# Altium schematic sheet CH32V003-NFC-EVT-R0-1v0.SchDoc
size 304 x 203 mm; SheetNumber: 0; SheetTotal: 0
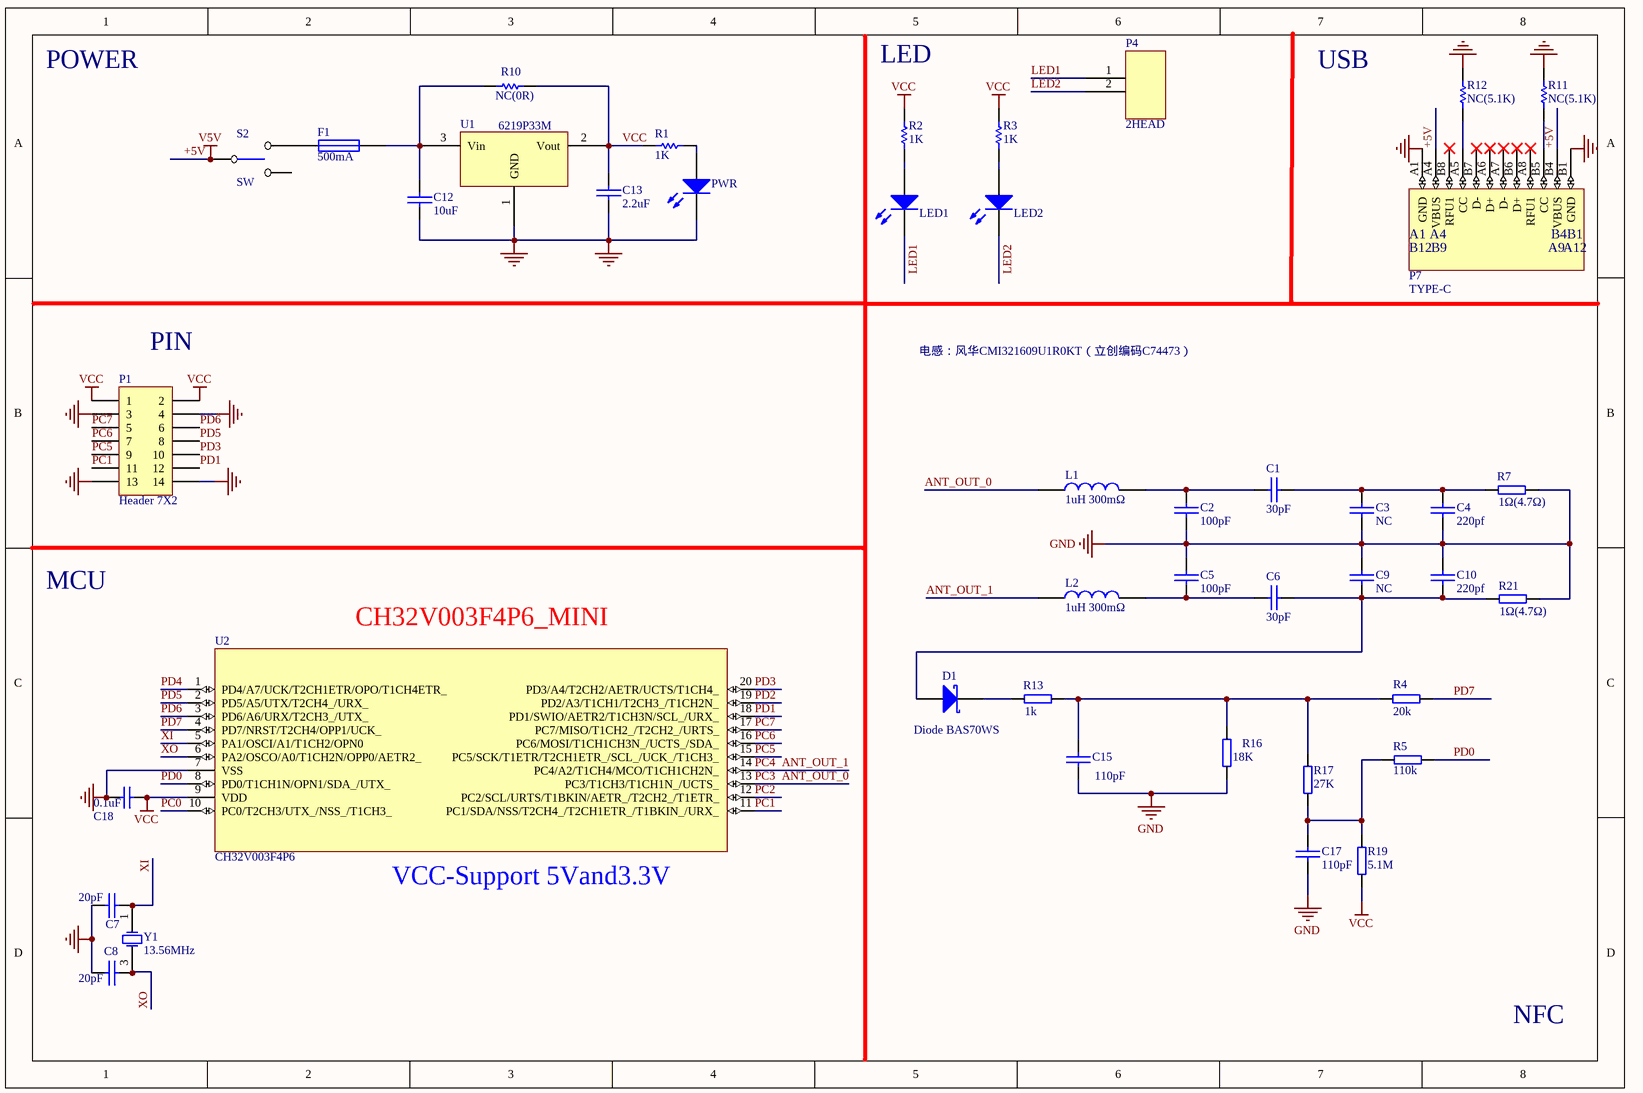
[diagram p0: CH32V003-NFC-EVT-R0-1v0.SchDoc]

## Parts
C1  30pF  [0603_C]
C2  100pF  [0603_C]
C3  NC  [0603_C]
C4  220pf  [0603_C]
C5  100pF  [0603_C]
C6  30pF  [0603_C]
C7  20pF  [0603_C]
C8  20pF  [0603_C]
C9  NC  [0603_C]
C10  220pf  [0603_C]
C12  10uF  [3216_C]
C13  2.2uF  [0603_C]
C15  110pF  [0603_C]
C17  110pF  [0603_C]
C18  0.1uF  [0603_C]
D1  Diode BAS70WS  [SOD-323]
F1  500mA  [0603]
L1  1uH 300mΩ  [0805]
L2  1uH 300mΩ  [0805]
LED1  LED1   blue  [0603+]  (value not drawn)
LED2  LED2  blue  [0603+]  (value not drawn)
P1  Header 7X2  [IDC14-2.54mm]
P4  2HEAD  [SIP2-2.54mm]
P7  TYPE-C  [TYPE-C-Receptacle-2.0]
PWR  POWER  red  [0603+]  (value not drawn)
R1  1K  [0603]
R2  1K  [0603]
R3  1K  [0603]
R4  20k  [0603]
R5  110k  [0603]
R7  1Ω(4.7Ω)  [0603]
R10  value NC(0R)  [0603]  (hidden comment: 0R)
R11  value NC(5.1K)  [0603]  (hidden comment: 0R)
R12  value NC(5.1K)  [0603]  (hidden comment: 0R)
R13  1k  [0603]
R16  18K  [0603]
R17  27K  [0603]
R19  5.1M  [0603]
R21  1Ω(4.7Ω)  [0603]
S2  SW  [SW1]
U1  6219P33M  [SOT-23]
U2  CH32V003F4P6  [TSSOP20]
Y1  13.56MHz  [XT3225]

## Nets
+5V: P7.A4(VBUS) P7.B4(VBUS) S2.1  [also labelled V5V]
GND: C2.1 C3.1 C4.1 C5.2 C7.1 C8.1 C9.2 C10.2 C12.2 C13.1 C15.1 C17.1 C18.1 P1.3 P1.4 P1.13 P1.14 P7.A1(GND) P7.B1(GND) PWR.2(K) R7.2 R11.2 R12.2 R16.1 R21.2 U1.1(GND) U2.7(VSS)
VCC: C13.2 C18.2 P1.1 P1.2 R1.2 R2.1 R3.1 R10.2 R19.1 U1.2(Vout) U2.9(VDD)
ANT_OUT_0: L1.1 U2.13(PC3/T1CH3/T1CH1N_/UCTS_)  [also labelled PC3]
ANT_OUT_1: L2.1 U2.14(PC4/A2/T1CH4/MCO/T1CH1CH2N_)  [also labelled PC4]
LED1: LED1.2(K) P4.1
LED2: LED2.2(K) P4.2
PC0: U2.10(PC0/T2CH3/UTX_/NSS_/T1CH3_)
PC1: P1.11 U2.11(PC1/SDA/NSS/T2CH4_/T2CH1ETR_/T1BKIN_/URX_)
PC2: U2.12(PC2/SCL/URTS/T1BKIN/AETR_/T2CH2_/T1ETR_)
PC5: P1.9 U2.15(PC5/SCK/T1ETR/T2CH1ETR_/SCL_/UCK_/T1CH3_)
PC6: P1.7 U2.16(PC6/MOSI/T1CH1CH3N_/UCTS_/SDA_)
PC7: P1.5 U2.17(PC7/MISO/T1CH2_/T2CH2_/URTS_)
PD0: R5.2 U2.8(PD0/T1CH1N/OPN1/SDA_/UTX_)
PD1: P1.12 U2.18(PD1/SWIO/AETR2/T1CH3N/SCL_/URX_)
PD2: U2.19(PD2/A3/T1CH1/T2CH3_/T1CH2N_)
PD3: P1.10 U2.20(PD3/A4/T2CH2/AETR/UCTS/T1CH4_)
PD4: U2.1(PD4/A7/UCK/T2CH1ETR/OPO/T1CH4ETR_)
PD5: P1.8 U2.2(PD5/A5/UTX/T2CH4_/URX_)
PD6: P1.6 U2.3(PD6/A6/URX/T2CH3_/UTX_)
PD7: R4.1 U2.4(PD7/NRST/T2CH4/OPP1/UCK_)
XI: C7.2 U2.5(PA1/OSCI/A1/T1CH2/OPN0) Y1.1(OSC1)
XO: C8.2 U2.6(PA2/OSCO/A0/T1CH2N/OPP0/AETR2_) Y1.3(OSC2)
NetC1_1: C1.1 C2.2 L1.2
NetC1_2: C1.2 C3.2 C4.2 R7.1
NetC5_1: C5.1 C6.1 L2.2
NetC6_2: C6.2 C9.1 C10.1 D1.1(A) R21.1
NetC12_1: C12.1 F1.2 R10.1 U1.3(Vin)
NetC15_2: C15.2 R4.2 R13.2 R16.2 R17.2
NetC17_2: C17.2 R5.1 R17.1 R19.2
NetD1_2: D1.2(K) R13.1
NetF1_1: F1.1 S2.3
NetLED1_1: LED1.1(A) R2.2
NetLED2_1: LED2.1(A) R3.2
NetP7_A5: P7.A5(CC) R12.1
NetP7_B5: P7.B5(CC) R11.1
NetPWR_1: PWR.1(A) R1.1

Not connected (* = marked no-connect by the designer): P7 A6(D+)* A7(D-)* A8(RFU1)* B6(D+)* B7(D-)* B8(RFU1)*; S2 2

## Notes on the sheet
- POWER
- (near R2) LED
- USB
- (near P1) PIN
- 电感：风华CMI321609U1R0KT（立创编码C74473）
- MCU
- CH32V003F4P6_MINI
- (near U2) VCC-Support 5Vand3.3V
- NFC
- Title
- Size:
- Date:
- A3
- Number:
- Time:
- Revision:
- Sheet
- of
- File:
- (in symbol TYPE-C1) B12; B9; A9; A12

## Library data of the parts
C1-C10 C12 C13 C15 C17 = CAP: Capacitor
C18 = Cap: Capacitor; Value: 15pF; Published: 8-Jun-2000; LatestRevisionDate: 17-Jul-2002; LatestRevisionNote: Re-released for DXP Platform.; PackageReference: RAD-0.3; Publisher: Altium Limited
D1 = Diode BAS70: Silicon AF Schottky Diode for High-Speed Switching; Note: Pin 2 is not connected and not drawn.; Published: 21-Mar-2003; LatestRevisionDate: 29-May-2009; LatestRevisionNote: IPC-7351 Footprint Added.; DatasheetVersion: Oct-1999; PackageVersion: Sep-2001; PackageReference: SOT-23; Publisher: Altium Limited; PackageDescription: 3-Pin SOT-23 Package 0.95 mm Pitch, 2.5 mm Lead Span; ComponentLink1Description: Manufacturer Link; ComponentLink1URL: http://www.infineon.com/; ComponentLink2Description: Datasheet; ComponentLink2URL: http://www.infineon.com/upload/Document/cmc_upload/documents/009/382/bas40_bas140series_1.pdf
F1 = FUSE1: Fuse
L1 L2 = INDUCTOR
LED1 LED2 PWR = LED0: Typical INFRARED GaAs LED; Published: 8-Jun-2000; LatestRevisionDate: 08-Jul-2005; LatestRevisionNote: Mech Layer 1 removed.; PackageReference: LED-0; Publisher: Altium Limited
P1 = Header 7X2: Header, 7-Pin, Dual row; LatestRevisionDate: 17-Jul-2002; LatestRevisionNote: Re-released for DXP Platform.; Publisher: Altium Limited
P7 = TYPE-C1
R1-R3 R10-R12 = Res Semi: Semiconductor Resistor; Published: 8-Jun-2000; LatestRevisionDate: 17-Jul-2002; LatestRevisionNote: Re-released for DXP Platform.; PackageReference: AXIAL-0.5; Publisher: Altium Limited
  R1-R3: Value: 1K
R4 R5 R7 R13 R16 R17 R19 R21 = RES
U2 = CH32V003F4P6: RISC-V MCU, 48MHz
Y1 = XTAL: Crystal Oscillator; Published: 8-Jun-2000; LatestRevisionDate: 17-Jul-2002; LatestRevisionNote: Re-released for DXP Platform.; PackageReference: R38; Publisher: Altium Limited; PackageDescription: Crystal, Thru-Hole; 2 Leads; Body 3.1 x 8.2 mm (Dia.xH)